# Altium schematic sheet Signal.SchDoc
size OrCAD A; SheetNumber: 3; SheetTotal: 4
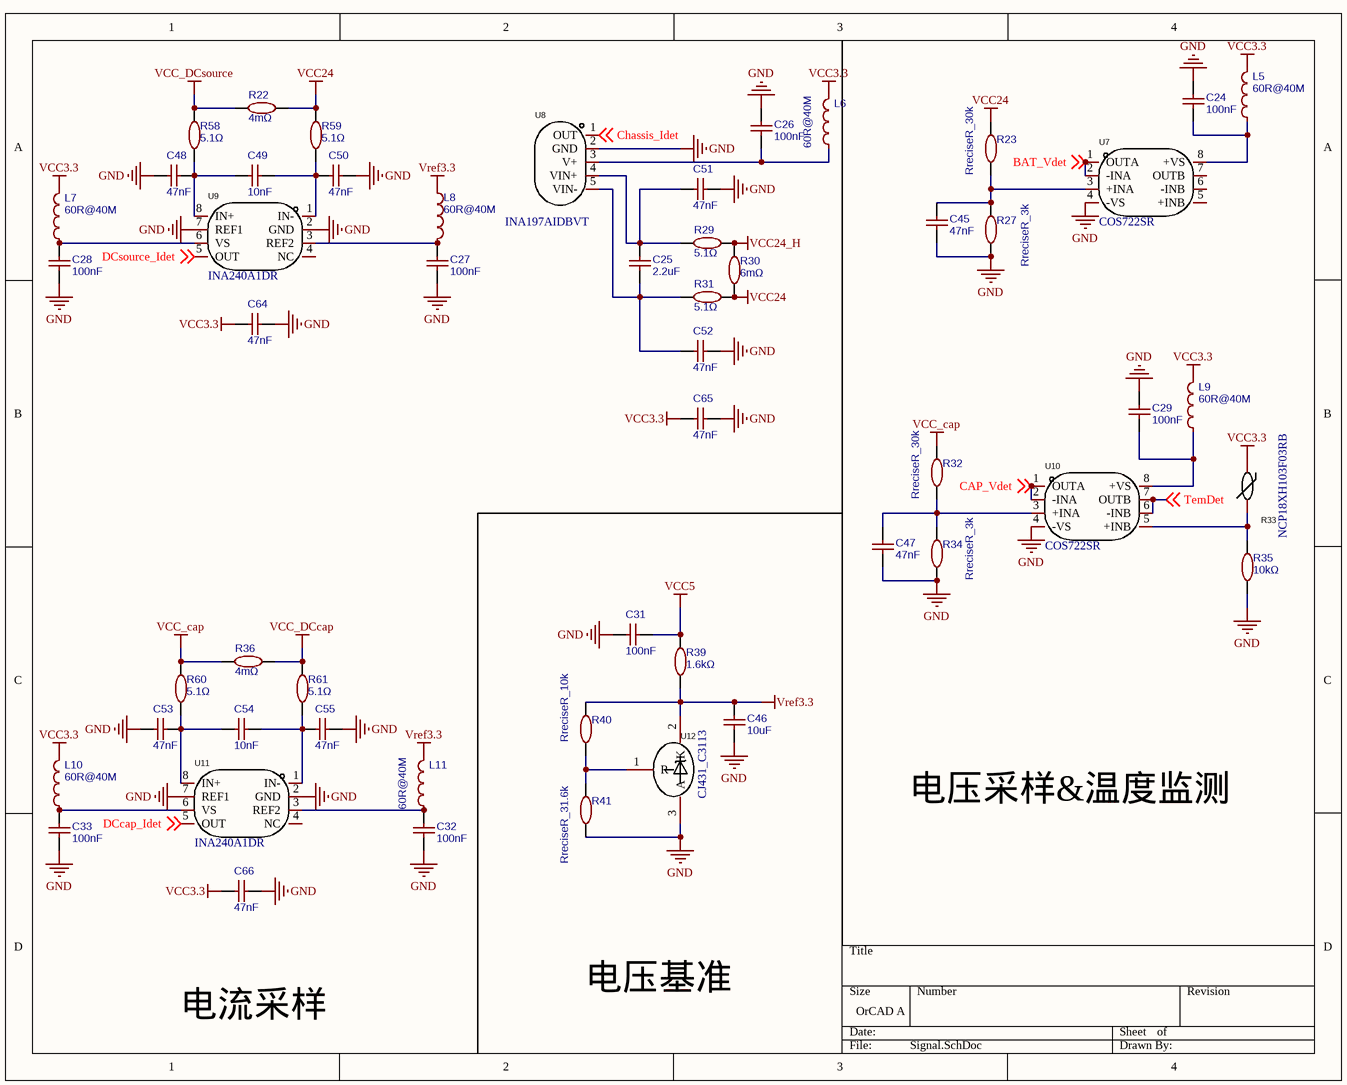
[diagram p0: Signal.SchDoc]

## Parts
C24  100nF  [C-RAD-0603]
C25  2.2uF  [C-RAD-0603]
C26  100nF  [C-RAD-0603]
C27  100nF  [C-RAD-0603]
C28  100nF  [C-RAD-0603]
C29  100nF  [C-RAD-0603]
C31  100nF  [C-RAD-0603]
C32  100nF  [C-RAD-0603]
C33  100nF  [C-RAD-0603]
C45  47nF  [C-RAD-0805]
C46  10uF  [C-RAD-0805]
C47  47nF  [C-RAD-0805]
C48  47nF  [C-RAD-0805]
C49  10nF  [C-RAD-0603]
C50  47nF  [C-RAD-0805]
C51  47nF  [C-RAD-0805]
C52  47nF  [C-RAD-0805]
C53  47nF  [C-RAD-0805]
C54  10nF  [C-RAD-0603]
C55  47nF  [C-RAD-0805]
C64  47nF  [C-RAD-0805]
C65  47nF  [C-RAD-0805]
C66  47nF  [C-RAD-0805]
L5  60R@40M  [0603-1]
L6  60R@40M  [0603-1]
L7  60R@40M  [0603-1]
L8  60R@40M  [0603-1]
L9  60R@40M  [0603-1]
L10  60R@40M  [0603-1]
L11  60R@40M  [0603-1]
R22  4mΩ  [2512]
R23  RreciseR_30k  [0603-1]
R27  RreciseR_3k  [0603-1]
R29  5.1Ω  [0603-1]
R30  6mΩ  [2512]
R31  5.1Ω  [0603-1]
R32  RreciseR_30k  [0603-1]
R33  NCP18XH103F03RB  [0603-1]
R34  RreciseR_3k  [0603-1]
R35  10kΩ  [0603-1]
R36  4mΩ  [2512]
R39  1.6kΩ  [0603-1]
R40  RreciseR_10k  [0603-1]
R41  RreciseR_31.6k  [0603-1]
R58  5.1Ω  [0603-1]
R59  5.1Ω  [0603-1]
R60  5.1Ω  [0603-1]
R61  5.1Ω  [0603-1]
U7  COS722SR  [SOIC127P610X175-8N]
U8  INA197AIDBVT  [SOT-23-5_L3.0-W1.7-P0.95-LS2.8-BL]
U9  INA240A1DR  [SOIC127P610X175-8N]
U10  COS722SR  [SOIC127P610X175-8N]
U11  INA240A1DR  [SOIC127P610X175-8N]
U12  CJ431_C3113  [SOT-23]

## Nets
GND: C24.2 C26.2 C27.2 C28.2 C29.2 C31.1 C32.2 C33.2 C45.1 C46.1 C47.1 C48.2 C50.1 C51.2 C52.2 C53.2 C55.2 C64.1 C65.1 C66.1 R27.1 R34.1 R35.2 R41.1 U7.4(-VS) U8.2(GND) U9.2(GND) U9.7(REF1) U10.4(-VS) U11.2(GND) U11.7(REF1) U12.3(A)
VCC3.3: C64.2 C65.2 C66.2 L5.2 L6.2 L7.2 L9.2 L10.2 R33.1
VCC5: C31.2 R39.2
VCC24: R22.2 R23.2 R30.1 R31.2 R59.2
VCC24_H: R29.2 R30.2
VCC_cap: R32.2 R36.1 R60.2
VCC_DCcap: R36.2 R61.2
VCC_DCsource: R22.1 R58.2
Vref3.3: C46.2 L8.1 L11.2 R39.1 R40.2 U12.2(K)
BAT_Vdet: U7.1(OUTA) U7.2(-INA) ; off-sheet BAT_Vdet
CAP_Vdet: U10.1(OUTA) U10.2(-INA) ; off-sheet CAP_Vdet
Chassis_Idet: U8.1(OUT) ; off-sheet Chassis_Idet
DCcap_Idet: U11.5(OUT) ; off-sheet DCcap_Idet
DCsource_Idet: U9.5(OUT) ; off-sheet DCsource_Idet
TemDet: U10.6(-INB) U10.7(OUTB) ; off-sheet TemDet
NetC24_1: C24.1 L5.1 U7.8(+VS)
NetC25_1: C25.1 C52.1 R31.1 U8.5(VIN-)
NetC25_2: C25.2 C51.1 R29.1 U8.4(VIN+)
NetC26_1: C26.1 L6.1 U8.3(V+)
NetC27_1: C27.1 L8.2 U9.3(REF2)
NetC28_1: C28.1 L7.1 U9.6(VS)
NetC29_1: C29.1 L9.1 U10.8(+VS)
NetC32_1: C32.1 L11.1 U11.3(REF2)
NetC33_1: C33.1 L10.1 U11.6(VS)
NetC45_2: C45.2 R23.1 R27.2 U7.3(+INA)
NetC47_2: C47.2 R32.1 R34.2 U10.3(+INA)
NetC48_1: C48.1 C49.1 R58.1 U9.8(IN+)
NetC49_2: C49.2 C50.2 R59.1 U9.1(IN-)
NetC53_1: C53.1 C54.1 R60.1 U11.8(IN+)
NetC54_2: C54.2 C55.1 R61.1 U11.1(IN-)
NetR33_2: R33.2 R35.1 U10.5(+INB)
NetR40_1: R40.1 R41.2 U12.1(R)

Not connected (* = marked no-connect by the designer): U7 5(+INB) 6(-INB) 7(OUTB); U9 4(NC); U11 4(NC)

## Notes on the sheet
- 电压采样&温度监测
- 电流采样
- 电压基准

## Library data of the parts
C24 C26-C29 C31-C33 = 100nF: BOM_Manufacturer: Guangdong Fenghua Advanced Tech; BOM_Manufacturer Part: 0805CG330J500NT; nameAlias: Capacitance; Contributor: LCSC; BOM_Supplier: LCSC; BOM_Supplier Part: C157687; BOM_JLCPCB Part Class: Extended Part; spicePre: C; spiceSymbolName: 0805CG330J500NT
C25 = 2.2uF: BOM_Manufacturer: Guangdong Fenghua Advanced Tech; BOM_Manufacturer Part: 0805CG330J500NT; nameAlias: Capacitance; Contributor: LCSC; BOM_Supplier: LCSC; BOM_Supplier Part: C157687; BOM_JLCPCB Part Class: Extended Part; spicePre: C; spiceSymbolName: 0805CG330J500NT
C45 C47 C48 C50-C53 C55 C64-C66 = 47nF: CL21B473KBCNNNC; BOM_Manufacturer: Guangdong Fenghua Advanced Tech; nameAlias: Capacitance; Contributor: LCSC; BOM_Supplier: LCSC; BOM_Supplier Part: C157687; BOM_Manufacturer Part: CL21B473KBCNNNC; BOM_JLCPCB Part Class: Extended Part; spicePre: C; spiceSymbolName: 0805CG330J500NT
C46 = 10uF: BOM_Manufacturer: Guangdong Fenghua Advanced Tech; BOM_Manufacturer Part: 0805CG330J500NT; nameAlias: Capacitance; Contributor: LCSC; BOM_Supplier: LCSC; BOM_Supplier Part: C157687; BOM_JLCPCB Part Class: Extended Part; spicePre: C; spiceSymbolName: 0805CG330J500NT
C49 C54 = 10nF: BOM_Manufacturer: Guangdong Fenghua Advanced Tech; BOM_Manufacturer Part: 0805CG330J500NT; nameAlias: Capacitance; Contributor: LCSC; BOM_Supplier: LCSC; BOM_Supplier Part: C157687; BOM_JLCPCB Part Class: Extended Part; spicePre: C; spiceSymbolName: 0805CG330J500NT
L5-L11 = 60R@40M: BOM_Manufacturer: FH; BOM_Manufacturer Part: CBW201209U601T; nameAlias: Value; BOM_Supplier: LCSC; BOM_Supplier Part: C21286; BOM_JLCPCB Part Class: Extended Part; spicePre: L; spiceSymbolName: CBW201209U601T
R22 R36 = 3mΩ: BOM_Manufacturer: UniOhm; BOM_Manufacturer Part: 0603WAF1002T5E; nameAlias: Resistance; Resistance (Ohms): 10K; BOM_Supplier: LCSC; BOM_Supplier Part: C25804; BOM_JLCPCB Part Class: Basic Part; spicePre: R; spiceSymbolName: 0603WAF1002T5E
R23 R32 = RreciseR_30k: BOM_Manufacturer: UniOhm; BOM_Manufacturer Part: 0603WAF1002T5E; nameAlias: Resistance; Resistance (Ohms): 10K; BOM_Supplier: LCSC; BOM_Supplier Part: C25804; BOM_JLCPCB Part Class: Basic Part; spicePre: R; spiceSymbolName: 0603WAF1002T5E
R27 R34 = RreciseR_3k: BOM_Manufacturer: UniOhm; BOM_Manufacturer Part: 0603WAF1002T5E; nameAlias: Resistance; Resistance (Ohms): 10K; BOM_Supplier: LCSC; BOM_Supplier Part: C25804; BOM_JLCPCB Part Class: Basic Part; spicePre: R; spiceSymbolName: 0603WAF1002T5E
R29 R31 R58-R61 = 5.1Ω: BOM_Manufacturer: UniOhm; BOM_Manufacturer Part: 0603WAF1002T5E; nameAlias: Resistance; Resistance (Ohms): 10K; BOM_Supplier: LCSC; BOM_Supplier Part: C25804; BOM_JLCPCB Part Class: Basic Part; spicePre: R; spiceSymbolName: 0603WAF1002T5E
R30 = 6mΩ: BOM_Manufacturer: UniOhm; BOM_Manufacturer Part: 0603WAF1002T5E; nameAlias: Resistance; Resistance (Ohms): 10K; BOM_Supplier: LCSC; BOM_Supplier Part: C25804; BOM_JLCPCB Part Class: Basic Part; spicePre: R; spiceSymbolName: 0603WAF1002T5E
R33 = NCP18XH103F03RB: Manufacturer: muRata(村田); Add into BOM: yes; Resistance @ 25℃: 10kΩ; Resistance Tolerance: ±1%; B Constant (25℃/50℃): 3380K; Power: 100mW; Steady State Current (Max): 310uA; B Constant (25℃/85℃): 3334K; B Constant (25℃/100℃): 3455K; Name: NCP18XH103F03RB; Symbol: NCP18XH103F03RB; Device: NCP18XH103F03RB; LCSC Part Name: 10kΩ 电阻精度:±1% 3380K; Supplier Part: C13564; Manufacturer Part: NCP18XH103F03RB; Supplier Footprint: 0603; JLCPCB Part Class: Extended Part; Datasheet: https://atta.szlcsc.com/upload/public/pdf/source/20130819/1457706638081.pdf; Supplier: LCSC; Convert to PCB: yes; B Constant Tolerance: ±1%; B Constant (25℃/75℃): -; Operating Temperature: -40℃~+125℃
R35 = 10kΩ: BOM_Manufacturer: UniOhm; BOM_Manufacturer Part: 0603WAF1002T5E; nameAlias: Resistance; Resistance (Ohms): 10K; BOM_Supplier: LCSC; BOM_Supplier Part: C25804; BOM_JLCPCB Part Class: Basic Part; spicePre: R; spiceSymbolName: 0603WAF1002T5E
R39 = 1.6kΩ: BOM_Manufacturer: UniOhm; BOM_Manufacturer Part: 0603WAF1002T5E; nameAlias: Resistance; Resistance (Ohms): 10K; BOM_Supplier: LCSC; BOM_Supplier Part: C25804; BOM_JLCPCB Part Class: Basic Part; spicePre: R; spiceSymbolName: 0603WAF1002T5E
R40 = RreciseR_10k: BOM_Manufacturer: UniOhm; BOM_Manufacturer Part: 0603WAF1002T5E; nameAlias: Resistance; Resistance (Ohms): 10K; BOM_Supplier: LCSC; BOM_Supplier Part: C25804; BOM_JLCPCB Part Class: Basic Part; spicePre: R; spiceSymbolName: 0603WAF1002T5E
R41 = RreciseR_31.6k: BOM_Manufacturer: UniOhm; BOM_Manufacturer Part: 0603WAF1002T5E; nameAlias: Resistance; Resistance (Ohms): 10K; BOM_Supplier: LCSC; BOM_Supplier Part: C25804; BOM_JLCPCB Part Class: Basic Part; spicePre: R; spiceSymbolName: 0603WAF1002T5E
U7 U10 = COS722SR: Manufacturer: COSINE(科山芯创); Add into BOM: yes; Number of Circuits: 2; Voltage - Input Offset(Vos): 5mV; Gain Bandwidth Product(GBP): 10MHz; Slew Rate(SR): 7.5V/us; Supply Current: 650uA; Name: COS722SR; Symbol: COS722SR; Device: COS722SR; LCSC Part Name: COS722SR; Supplier Part: C693063; Manufacturer Part: COS722SR; Supplier Footprint: SOIC-8; JLCPCB Part Class: Extended Part; Datasheet: https://atta.szlcsc.com/upload/public/pdf/source/20200629/C693056_2991DE5392421DDCA1474C8C5608148D.pdf; Supplier: LCSC; Convert to PCB: yes
U8 = INA197AIDBVT: Manufacturer: TI(德州仪器); Add into BOM: yes; Name: INA197AIDBVT; Symbol: INA197AIDBVT; Device: INA197AIDBVT; LCSC Part Name: INA197AIDBVT; Supplier Part: C140332; Manufacturer Part: INA197AIDBVT; Supplier Footprint: SOT-23-5; JLCPCB Part Class: Extended Part; Datasheet: https://atta.szlcsc.com/upload/public/pdf/source/20171221/C140332_15138310678791195272.pdf; Supplier: LCSC; Convert to PCB: yes
U9 U11 = INA240A1DR: Manufacturer: TI(德州仪器); Add into BOM: yes; Name: INA240A1DR; Symbol: INA240A1DR; Device: INA240A1DR; LCSC Part Name: INA240A1DR; Supplier Part: C2060769; Manufacturer Part: INA240A1DR; Supplier Footprint: SOIC-8; JLCPCB Part Class: Extended Part; Datasheet: https://atta.szlcsc.com/upload/public/pdf/source/20210607/AED5CCB0280C8C5A414BD6EEEB43F6C3.pdf; Supplier: LCSC; Convert to PCB: yes
U12 = CJ431_C3113: Manufacturer: CJ(江苏长电/长晶); Name: CJ431; Add into BOM: yes; Output Type: 可调; Output Voltage: 2.5V~36V; Output Current: 100mA; Tolerance: ±0.5%; Temperature Coefficient: 50ppm/℃; Minimum Cathode Current for Regulation: 1mA; Symbol: CJ431_C3113; Device: CJ431_C3113; LCSC Part Name: 2.5V~36V 100mA; Supplier Part: C3113; Manufacturer Part: CJ431; Supplier Footprint: SOT-23; JLCPCB Part Class: Basic Part; Datasheet: https://atta.szlcsc.com/upload/public/pdf/source/20180115/C3113_15160149461261269385.pdf; Supplier: LCSC; Convert to PCB: yes; Operating Temperature: -25℃~+85℃@(TA)